# EAGLE schematic MIC2250-1YD5-TR_breakout (EAGLE 8.5.1)
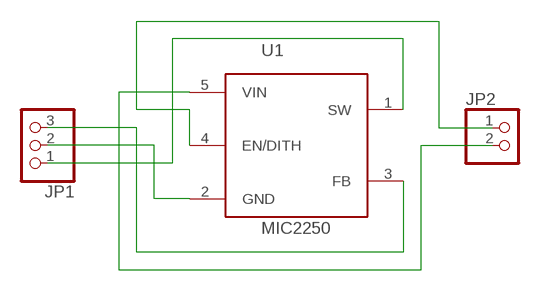
[diagram p0: schematic, sheet 1]

## Parts
JP1  PINHD-1X3  [1X03]
JP2  PINHD-1X2  [1X02]
U1  MIC2250  [SOT95P270X145-5N]

## Nets
EN/DITH: JP2.1 U1.4(EN/DITH)
FB: JP1.3 U1.3(FB)
GND: JP1.2 U1.2(GND)
SW: JP1.1 U1.1(SW)
VIN: JP2.2 U1.5(VIN)

## Library data of the parts
JP1 = pinhead:PINHD-1X3: PIN HEADER
JP2 = pinhead:PINHD-1X2: PIN HEADER
U1 = MIC2250:MIC2250; DESCR: IC REG BOOST ADJ 0.9A SOT23-5; MF: MICROCHIP; PACKAGE: SC-74A, SOT-753